# Altium schematic sheet Cap_Mux.SchDoc: Adjustable Capacitor Bank
size A3; Author: M.Beldyga; CompanyName: WUT ISE; DrawnBy: M.Beldyga; Organization: WUT ISE; Address1: PW ISE; Address2: Nowowiejska 15/19 00-665 Warsaw; Address3: micbeldyga@gmail.com; SheetNumber: 3; SheetTotal: 5; ModifiedBy: -; CheckedDate: -; Title2: 10pF-1uF; DivGrp: WUT ISE; Designer: M.Beldyga; ModifiedDate: -; ProjectName: Sensor Box
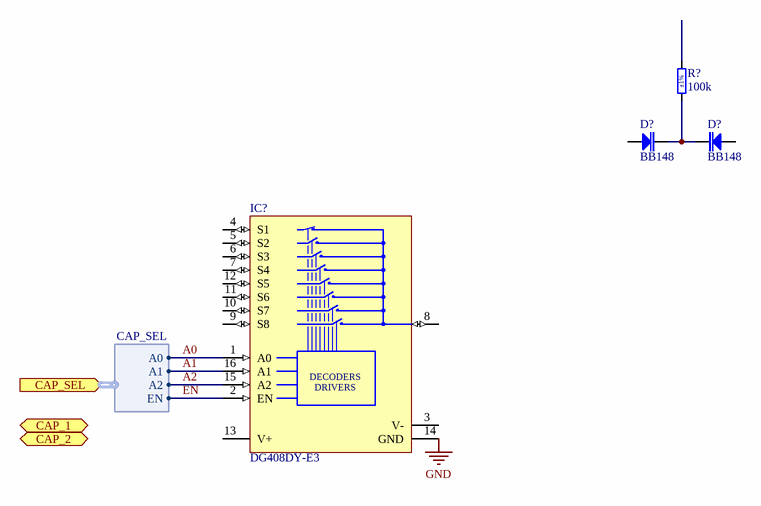
[diagram p0: Cap_Mux.SchDoc]

## Parts
(Parts that share a designator on the sheet are numbered #1, #2 ... from top to bottom, then left to right.)
D?#1  BB148  [SOD2512X110N]
D?#2  BB148  [SOD2512X110N]
IC?  DG408DY-E3  [SOIC127P600X175-16N]
R?  100k  Tolerance: ±1%  [RESC1005X40N]

## Ports
CAP_1 (bidir), CAP_2 (bidir), CAP_SEL (in, harness CAP_SEL)

## Harnesses
CAP_SEL: A0, A1, A2, EN

## Nets
GND: IC?.14(GND)
A0: IC?.1(A0) ; port CAP_SEL.A0
A1: IC?.16(A1) ; port CAP_SEL.A1
A2: IC?.15(A2) ; port CAP_SEL.A2
EN: IC?.2(EN) ; port CAP_SEL.EN
NetD?#1_1: D?#1.1(C) D?#2.1(C) R?.1

Not connected (* = marked no-connect by the designer): D?#1 2(A); D?#2 2(A); IC? 3(V-) 4(S1) 5(S2) 6(S3) 7(S4) 8(D) 9(S8) 10(S7) 11(S6) 12(S5) 13(V+); R? 2

## Notes on the sheet
- Project/Equipment
- Document
- Designer
- Drawn by
- Check.by
- Contact
- File
- Last Mod.
- Print Date
- Sheet
- Size
- A3
- of
- Rev
- (in symbol DG408DY-E3) DECODERS; DRIVERS

## Library data of the parts
D?#1 D?#2 = BB148: Diode Varicap  Anode Pin 1 Cathode Pin 3 (Pas de pin 2); Part Description: VHF Variable Capacitance Diode; Manufacturer: NXP SEMICONDUCTORS; Voltage: 30V; Power: 20mA; PressFit: No; Bonding: No; Part Number: BB148; Component Kind: Standard; Component Type: Standard; Device: BB148; PackageDescription: Small Outline Diode (SOD-323), 1.70mm W X 1.25mm L X 1.10mm H body,  IPC Medium Density; Status: Obsolete; Manufacturer Part Number: BB148; Pin Count: 2; Case: SOD-323; Mounted: Yes; Socket: No; SMD: Yes; Sense: No; ComponentHeight: 1.1mm; HelpURL: \\cern.ch\dfs\Applications\Altium\Datasheets\BB148.pdf; Author: CERN DEM JLC; CreateDate: 1/13/2014; LatestRevisionDate: 1/13/2014
IC? = DG408DY-E3: 8-Channel High-Performance CMOS Analog Multiplexer; Part Description: 8-Channel High-Performance CMOS Analog Multiplexers; Manufacturer: VISHAY SILICONIX; PressFit: No; Bonding: No; Part Number: DG408DY-E3; Component Kind: Standard; Component Type: Standard; Device: DG408DY-E3; PackageDescription: SOIC 16, Pitch 1.27mm - Body 4x10mm, IPC Medium Density; Manufacturer Part Number: DG408DY-E3; Pin Count: 16; Case: SOIC16; Mounted: Yes; Socket: No; SMD: Yes; Sense: No; ComponentHeight: 1.75mm; Author: CERN DEM MR; HelpURL: \\cern.ch\dfs\Applications\Altium\Datasheets\DG408DY-E3.pdf; CreateDate: 7/22/2016; LatestRevisionDate: 7/22/2016
R? = R0402_100K_1%_0.0625W_100PPM: Resistor - 1%; Part Description: General Purpose Thick Film Chip Resistor; Manufacturer: GENERIC; Manufacturer1 Part Number: 232270671004L; TC: ±100ppm/°C; PressFit: No; Part Number: R0402_100K_1%_0.0625W_100PPM; Component Kind: Standard; Component Type: Standard; Pin Count: 2; Value: 100k; Status: Not Recommended; Power: 0.0625W; Manufacturer Part Number: R0402_100K_1%_0.0625W_100PPM; Case: 0402; Mounted: Yes; Sense: No; Socket: No; SMD: Yes; Manufacturer1 Example: YAGEO PHYCOMP; Manufacturer1 ComponentHeight: 0.4mm; HelpURL: \\cern.ch\dfs\Applications\Altium\Datasheets\R0402_Phycomp_RC0402.pdf; Author: CERN DEM JLC; CreateDate: 12/3/2007; LatestRevisionDate: 10/17/2012